# Altium schematic sheet Top.SchDoc: Top
size A4; Date: Not used; ApprovedBy: Not used; CheckedBy: Not used; Author: Not used; CompanyName: STMicroelectronics; DrawnBy: Not used; Engineer: Not used; Organization: Not used; Address1: Not used; Address2: Not used; Address3: Not used; Address4: Not used; DocumentNumber: 2; Revision: A-01-P3; SheetNumber: 2; SheetTotal: 8; CurrentTime: Not used; CurrentDate: Not used; Time: Not used; DocumentFullPathAndName: Not used; DocumentName: Not used; ModifiedDate: Not used; ImagePath: Not used; ProjectName: Not used; Application_BuildNumber: Not used
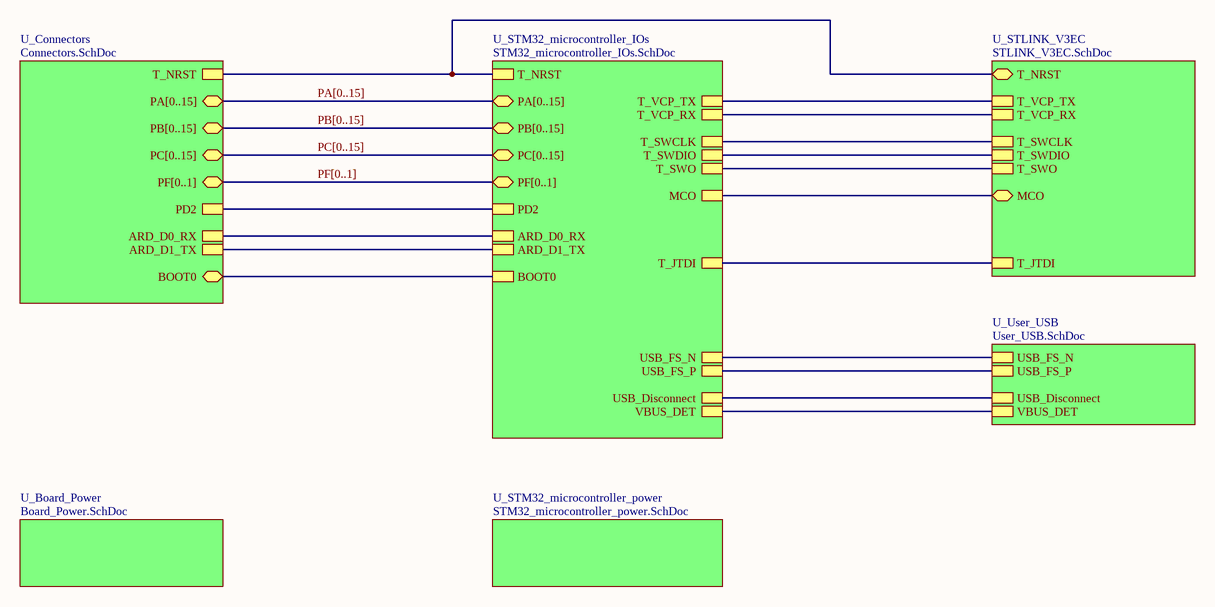
[diagram p0: Top.SchDoc]

## Sub-sheets
U_Board_Power = Board_Power.SchDoc: no entries
U_Connectors = Connectors.SchDoc: PA[0..15] (bidir), PB[0..15] (bidir), PC[0..15] (bidir), PD2, T_NRST, PF[0..1] (bidir), ARD_D0_RX, ARD_D1_TX, BOOT0 (bidir)
U_STLINK_V3EC = STLINK_V3EC.SchDoc: T_NRST (bidir), MCO (bidir), T_VCP_RX, T_VCP_TX, T_JTDI, T_SWCLK, T_SWO, T_SWDIO
U_STM32_microcontroller_IOs = STM32_microcontroller_IOs.SchDoc: PA[0..15] (bidir), PB[0..15] (bidir), PC[0..15] (bidir), PF[0..1] (bidir), ARD_D0_RX, ARD_D1_TX, MCO, PD2, T_NRST, T_VCP_TX, T_VCP_RX, T_SWCLK, T_SWO, T_SWDIO, T_JTDI, USB_FS_N, USB_FS_P, BOOT0, USB_Disconnect, VBUS_DET
U_STM32_microcontroller_power = STM32_microcontroller_power.SchDoc: no entries
U_User_USB = User_USB.SchDoc: VBUS_DET, USB_FS_N, USB_FS_P, USB_Disconnect

## Nets
(unnamed): sheet U_STM32_microcontroller_IOs/ARD_D0_RX, sheet U_Connectors/ARD_D0_RX
(unnamed): sheet U_STM32_microcontroller_IOs/ARD_D1_TX, sheet U_Connectors/ARD_D1_TX
(unnamed): sheet U_STM32_microcontroller_IOs/MCO, sheet U_STLINK_V3EC/MCO
(unnamed): sheet U_STM32_microcontroller_IOs/PD2, sheet U_Connectors/PD2
(unnamed): sheet U_STM32_microcontroller_IOs/T_NRST, sheet U_Connectors/T_NRST, sheet U_STLINK_V3EC/T_NRST
(unnamed): sheet U_STM32_microcontroller_IOs/T_VCP_TX, sheet U_STLINK_V3EC/T_VCP_TX
(unnamed): sheet U_STM32_microcontroller_IOs/T_VCP_RX, sheet U_STLINK_V3EC/T_VCP_RX
(unnamed): sheet U_STM32_microcontroller_IOs/T_SWCLK, sheet U_STLINK_V3EC/T_SWCLK
(unnamed): sheet U_STM32_microcontroller_IOs/T_SWO, sheet U_STLINK_V3EC/T_SWO
(unnamed): sheet U_STM32_microcontroller_IOs/T_SWDIO, sheet U_STLINK_V3EC/T_SWDIO
(unnamed): sheet U_STM32_microcontroller_IOs/T_JTDI, sheet U_STLINK_V3EC/T_JTDI
(unnamed): sheet U_STM32_microcontroller_IOs/USB_FS_N, sheet U_User_USB/USB_FS_N
(unnamed): sheet U_STM32_microcontroller_IOs/USB_FS_P, sheet U_User_USB/USB_FS_P
(unnamed): sheet U_STM32_microcontroller_IOs/BOOT0, sheet U_Connectors/BOOT0
(unnamed): sheet U_STM32_microcontroller_IOs/USB_Disconnect, sheet U_User_USB/USB_Disconnect
(unnamed): sheet U_STM32_microcontroller_IOs/VBUS_DET, sheet U_User_USB/VBUS_DET

## Buses and harness runs
bus PA[0..15] = sheet U_Connectors/PA[0..15] = sheet U_STM32_microcontroller_IOs/PA[0..15]
bus PB[0..15] = sheet U_Connectors/PB[0..15] = sheet U_STM32_microcontroller_IOs/PB[0..15]
bus PC[0..15] = sheet U_Connectors/PC[0..15] = sheet U_STM32_microcontroller_IOs/PC[0..15]
bus PF[0..1] = sheet U_Connectors/PF[0..1] = sheet U_STM32_microcontroller_IOs/PF[0..1]

## Notes on the sheet
- Title:
- Project:
- Size:
- Revision:
- Variant:
- A4
- -
- Date:
- Reference:
- Sheet:
- of